# Altium schematic sheet struct.SchDoc
size 840 x 594 mm; CompanyName: БГУИР, 750701; SheetNumber: 2; SheetTotal: 2; Разраб.: Соколов; Пров.: Смирнова
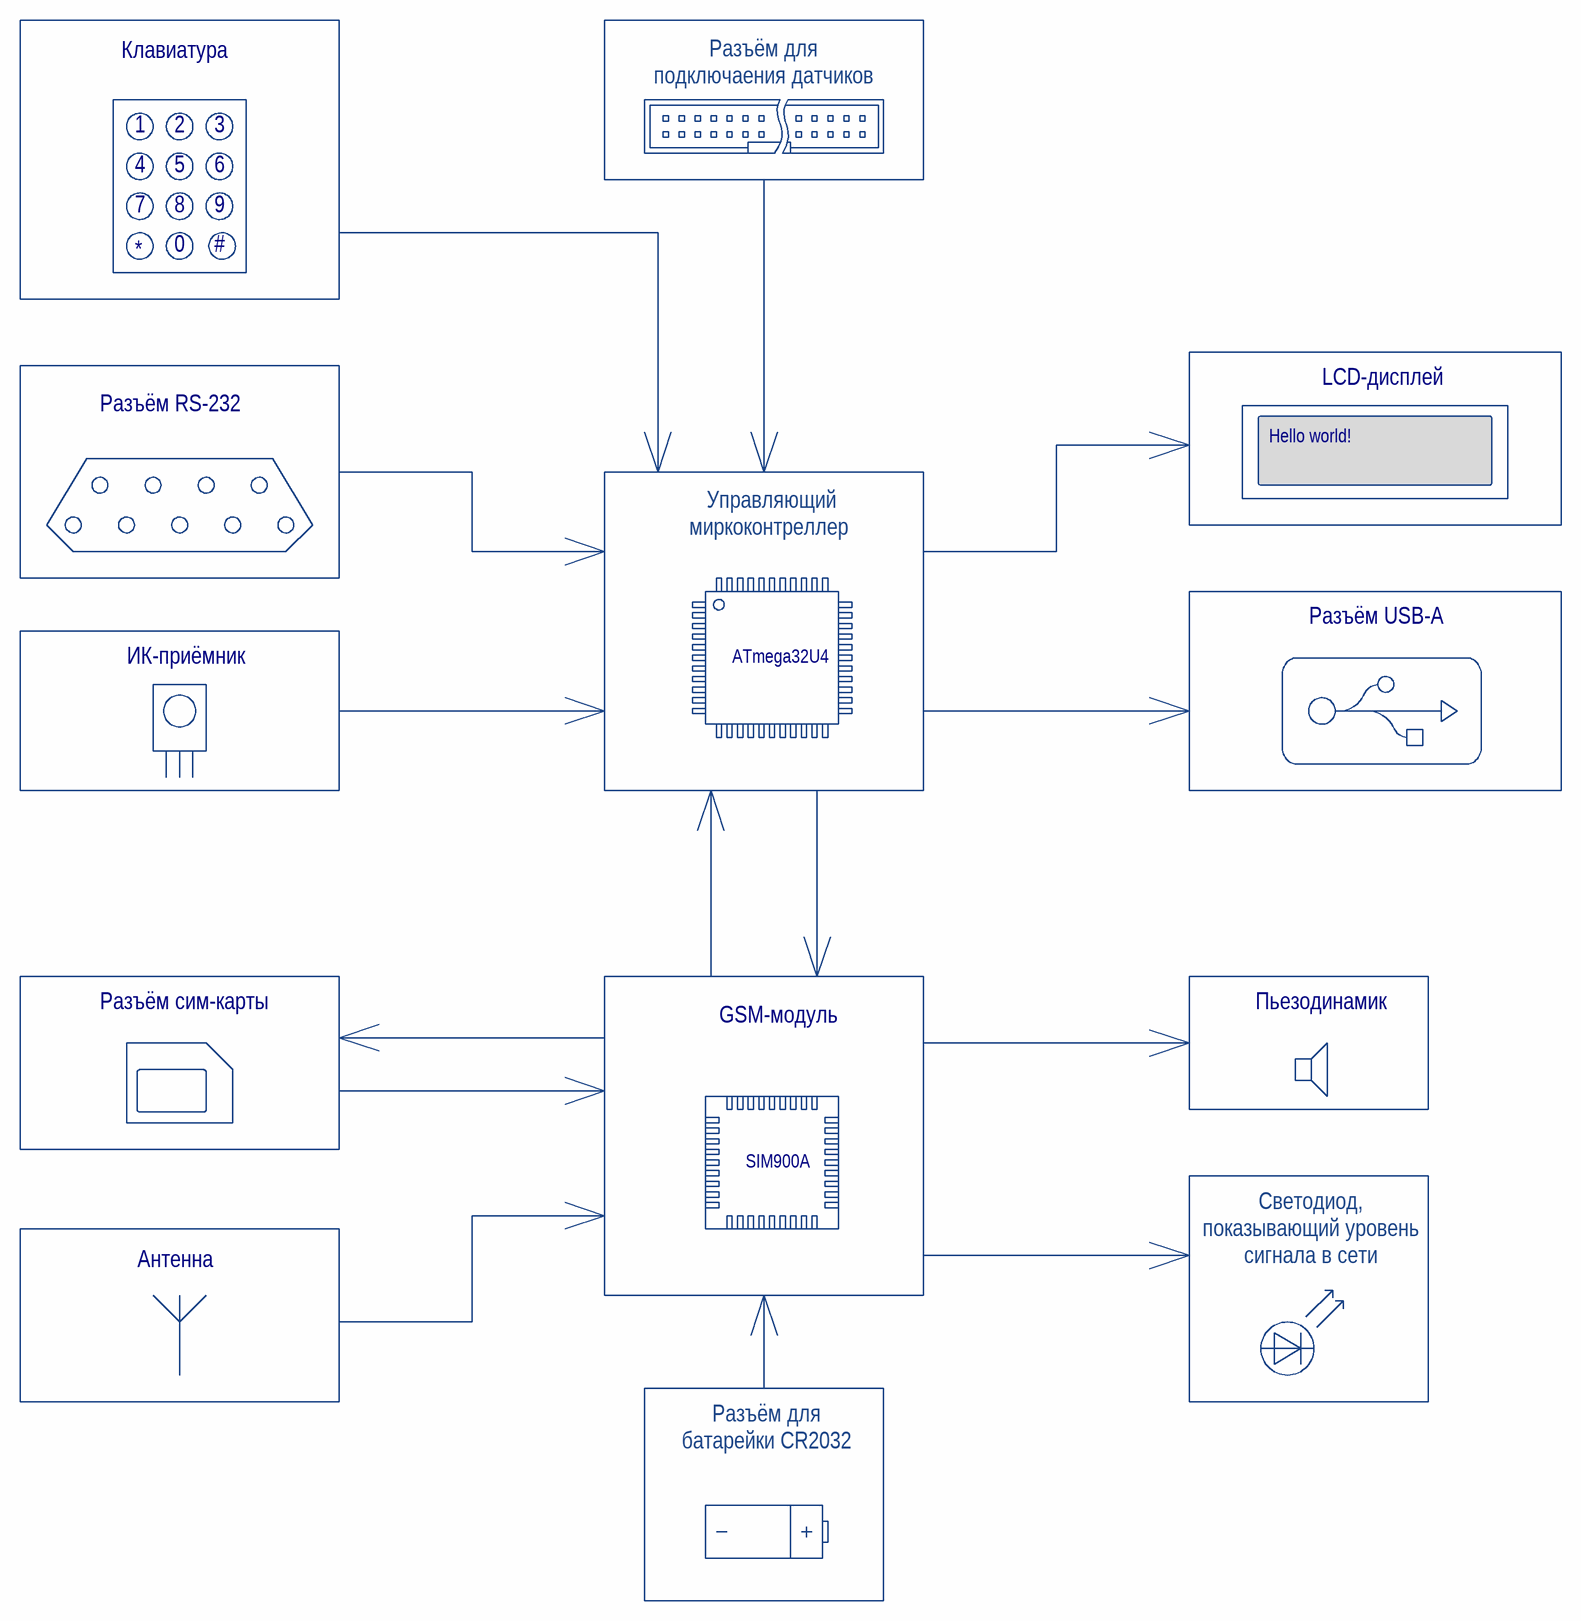
[diagram p0: struct.SchDoc]

## Notes on the sheet
- Клавиатура
- Разъём для подключаения датчиков
- 1
- 4
- 5
- 2
- 3
- 6
- 7
- 8
- 9
- *
- 0
- #
- Разъём RS-232
- Hello world!
- LCD-дисплей
- Управляющий миркоконтреллер
- Разъём USB-A
- ИК-приёмник
- ATmega32U4
- Разъём сим-карты
- GSM-модуль
- Пьезодинамик
- SIM900A
- Антенна
- Светодиод, показывающий уровень сигнала в сети
- Разъём для батарейки CR2032
- Перв. примен.
- Справ. №
- Подп. и дата
- Инв. № дубл.
- Взам. инв. №
- Разраб.
- Изм.
- Лист
- № докум.
- Подп.
- Дата
- Лит.
- Масса
- Масштаб
- Пров.
- Т. контр.
- Листов
- Инв. № подл.
- Н. контр.
- Утв.
- Копировал
- Формат А1